# EAGLE design DPS310_Pressure (EAGLE 8.0.2)
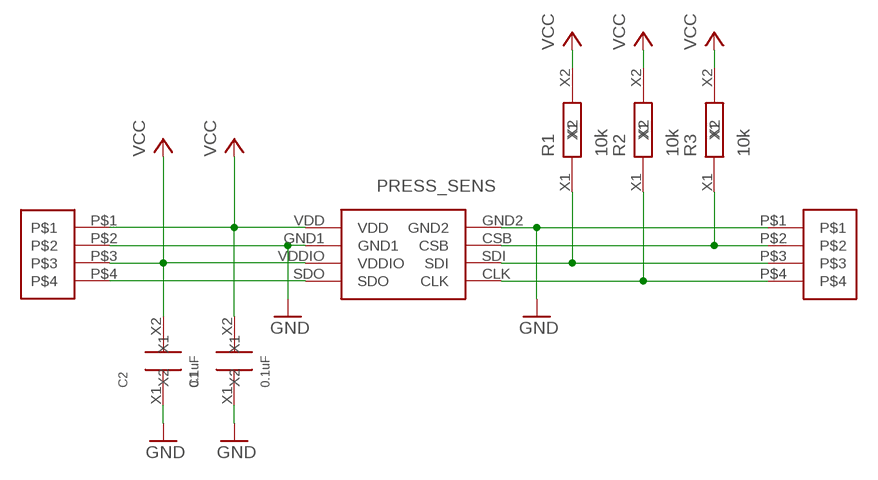
[diagram p0: schematic, sheet 1]

## Parts
C1  0.1uF  C_SMD_2.1X1.25  [SMD_2.1X1.25]
C2  0.1uF  C_SMD_2.1X1.25  [SMD_2.1X1.25]
PRESS_SENS  DPS310_INFINEON  [DSP310]
R1  10k  R_SMD_2.1X1.25  [SMD_2.1X1.25]
R2  10k  R_SMD_2.1X1.25  [SMD_2.1X1.25]
R3  10k  R_SMD_2.1X1.25  [SMD_2.1X1.25]
U$1  4-PIN-NONAME  [4-PIN-NONAME]
U$2  4-PIN-NONAME  [4-PIN-NONAME]

## Nets
GND: C1.X1 C2.X1 PRESS_SENS.GND1 PRESS_SENS.GND2 U$1.P$1 U$2.P$2
N$2: PRESS_SENS.CSB R3.X1 U$1.P$2
N$3: PRESS_SENS.SDI R1.X1 U$1.P$3
N$4: PRESS_SENS.CLK R2.X1 U$1.P$4
N$5: PRESS_SENS.SDO U$2.P$4
VCC: C1.X2 C2.X2 PRESS_SENS.VDD PRESS_SENS.VDDIO R1.X2 R2.X2 R3.X2 U$2.P$1 U$2.P$3

## Library data of the parts
C1 C2 = MyPowerComponents:C_SMD_2.1X1.25
PRESS_SENS = My_INFINEON:DPS310_INFINEON
R1-R3 = MyPowerComponents:R_SMD_2.1X1.25
U$1 U$2 = MyAmSys:4-PIN-NONAME

## Board
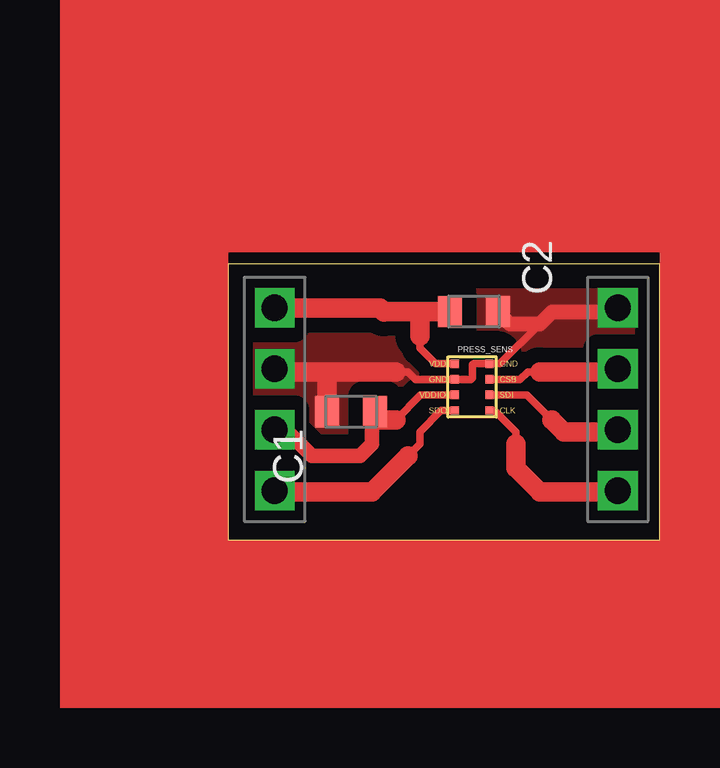
[diagram p1: board, top side]
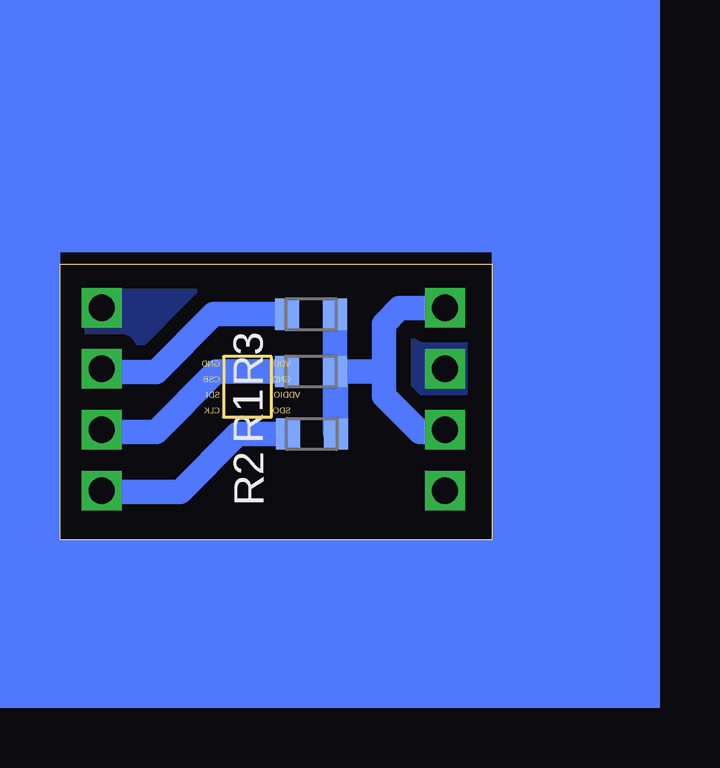
[diagram p2: board, bottom side, seen from below]

Size 18 x 11.5 mm. Coordinates in mm from the lower left corner, seen from the top.
Outline: 0,0 18,0 18,11.5 0,11.5 0,0
Copper layers (1*16): Top 0.035mm / dielectric 1.5mm / Bottom 0.035mm
Design rules "default": minimum track width 10mil, minimum drill 24mil, track to track 8mil, track to pad 8mil, pad to pad 8mil, via to via 8mil, smd to smd 8mil, copper to edge 40mil, drill to drill 8mil, minimum pad ring 10mil, minimum via ring 8mil, stop-mask expansion 4mil, vias tented up to drill 0mil, thermal gap 10mil

### Footprints (pad centres in the part's own frame; a part is rotated, then mirrored left to right if it is on the bottom)
SMD_2.1X1.25 = smd 1.3 x 1: X1 0,1; X2 0,-1
DSP310 = smd 0.35 x 0.35: CLK 0.725,-0.975; CSB 0.725,0.325; GND1 -0.725,0.325; GND2 0.725,0.975; SDI 0.725,-0.325; SDO -0.725,-0.975; VDD -0.725,0.975; VDDIO -0.725,-0.325
4-PIN-NONAME = drill 1.1 square: P$1 0,2.54; P$2 0,0; P$3 0,-2.54; P$4 0,-5.08

### Placement (x,y rotation side)
C1  5.14,5.33 90 top
C2  10.26,9.51 270 top
PRESS_SENS  10.18,6.36 0 top
R1  7.53,7.01 90 bottom
R2  7.5,4.41 90 bottom
R3  7.53,9.4 90 bottom
U$1  16.26,7.12 0 top
U$2  1.95,7.12 0 top

### Tracks (layer width: path | path; a pad name or v marks a point on that pad's centre or on a via)
GND
  Top 0.305: 13,9 11.34,7.33 PRESS_SENS.GND2 10.89,7.35 10.25,7.35 10.2,7.3 10.2,6.75 10.13,6.68 PRESS_SENS.GND1 7.82,6.68 7.5,7 7,7
  Top 0.61: U$1.P$1 16.1,9.5 13.5,9.5 13,9 11.77,9 C2.X1
  Top 0.813: 4,7 7,7 | 4,7 2.07,7 U$2.P$2 | C1.X1 4.14,6.86 4,7
  pour Top (isolate 0.61, no thermals): 0,0 0,11.5 18,11.5 18,0
  pour Bottom (isolate 0.61, no thermals): 0,0 0,11.5 18,11.5 18,0
N$2
  Top 0.305: PRESS_SENS.CSB 12.19,6.68 12.5,7 13,7
  Top 0.813: 13,7 16.14,7 U$1.P$2
  Bottom 1.016: R3.X1 11.6,9.4 14,7 16.14,7 U$1.P$2
N$3
  Top 0.305: PRESS_SENS.SDI 12.46,6.04 13.5,5
  Top 0.813: 13.5,5 14,4.5 16.18,4.5 U$1.P$3
  Bottom 1.016: R1.X1 11.49,7.01 14,4.5 16.18,4.5 U$1.P$3
N$4
  Top 0.305: PRESS_SENS.CLK 11.12,5.38 12,4.5 12,4
  Top 0.813: 12,4 12,3 13,2 16.22,2 U$1.P$4
  Bottom 1.016: R2.X1 10.59,4.41 13,2 16.22,2 U$1.P$4
N$5
  Top 0.305: PRESS_SENS.SDO 8.88,5.38 8,4.5 8,4 7.5,3.5
  Top 0.813: U$2.P$4 1.99,2 6,2 7.5,3.5
VCC
  Top 0.305: PRESS_SENS.VDD 8.66,7.33 8,8 8,8.5 | PRESS_SENS.VDDIO 8.04,6.04 7,5
  Top 0.61: U$2.P$3 2.42,4.58 3.5,3.5 5.5,3.5 6,4 6,4.94 C1.X2
  Top 0.813: 7,5 6.22,5 C1.X2 | U$2.P$1 6.34,9.66 6.5,9.5 6.51,9.51 8,9.51 | 8,9.51 C2.X2 | 8,8.5 8,9.51
  Bottom 1.016: U$2.P$1 3.84,9.66 4.5,9 4.5,7 | 4.5,7 4.5,6 3,4.5 2.03,4.5 U$2.P$3 | R3.X2 R1.X2 | R1.X2 6.53,4.44 R2.X2 6.5,6.98 R1.X2 | R1.X2 4.51,7.01 4.5,7
(copper drawn outside any net)
  shapes: Bottom area x6, Top area x4